# EAGLE schematic SparkFun RTK Facet - Main (EAGLE 9.6.2)

## Sheet 1 of 2
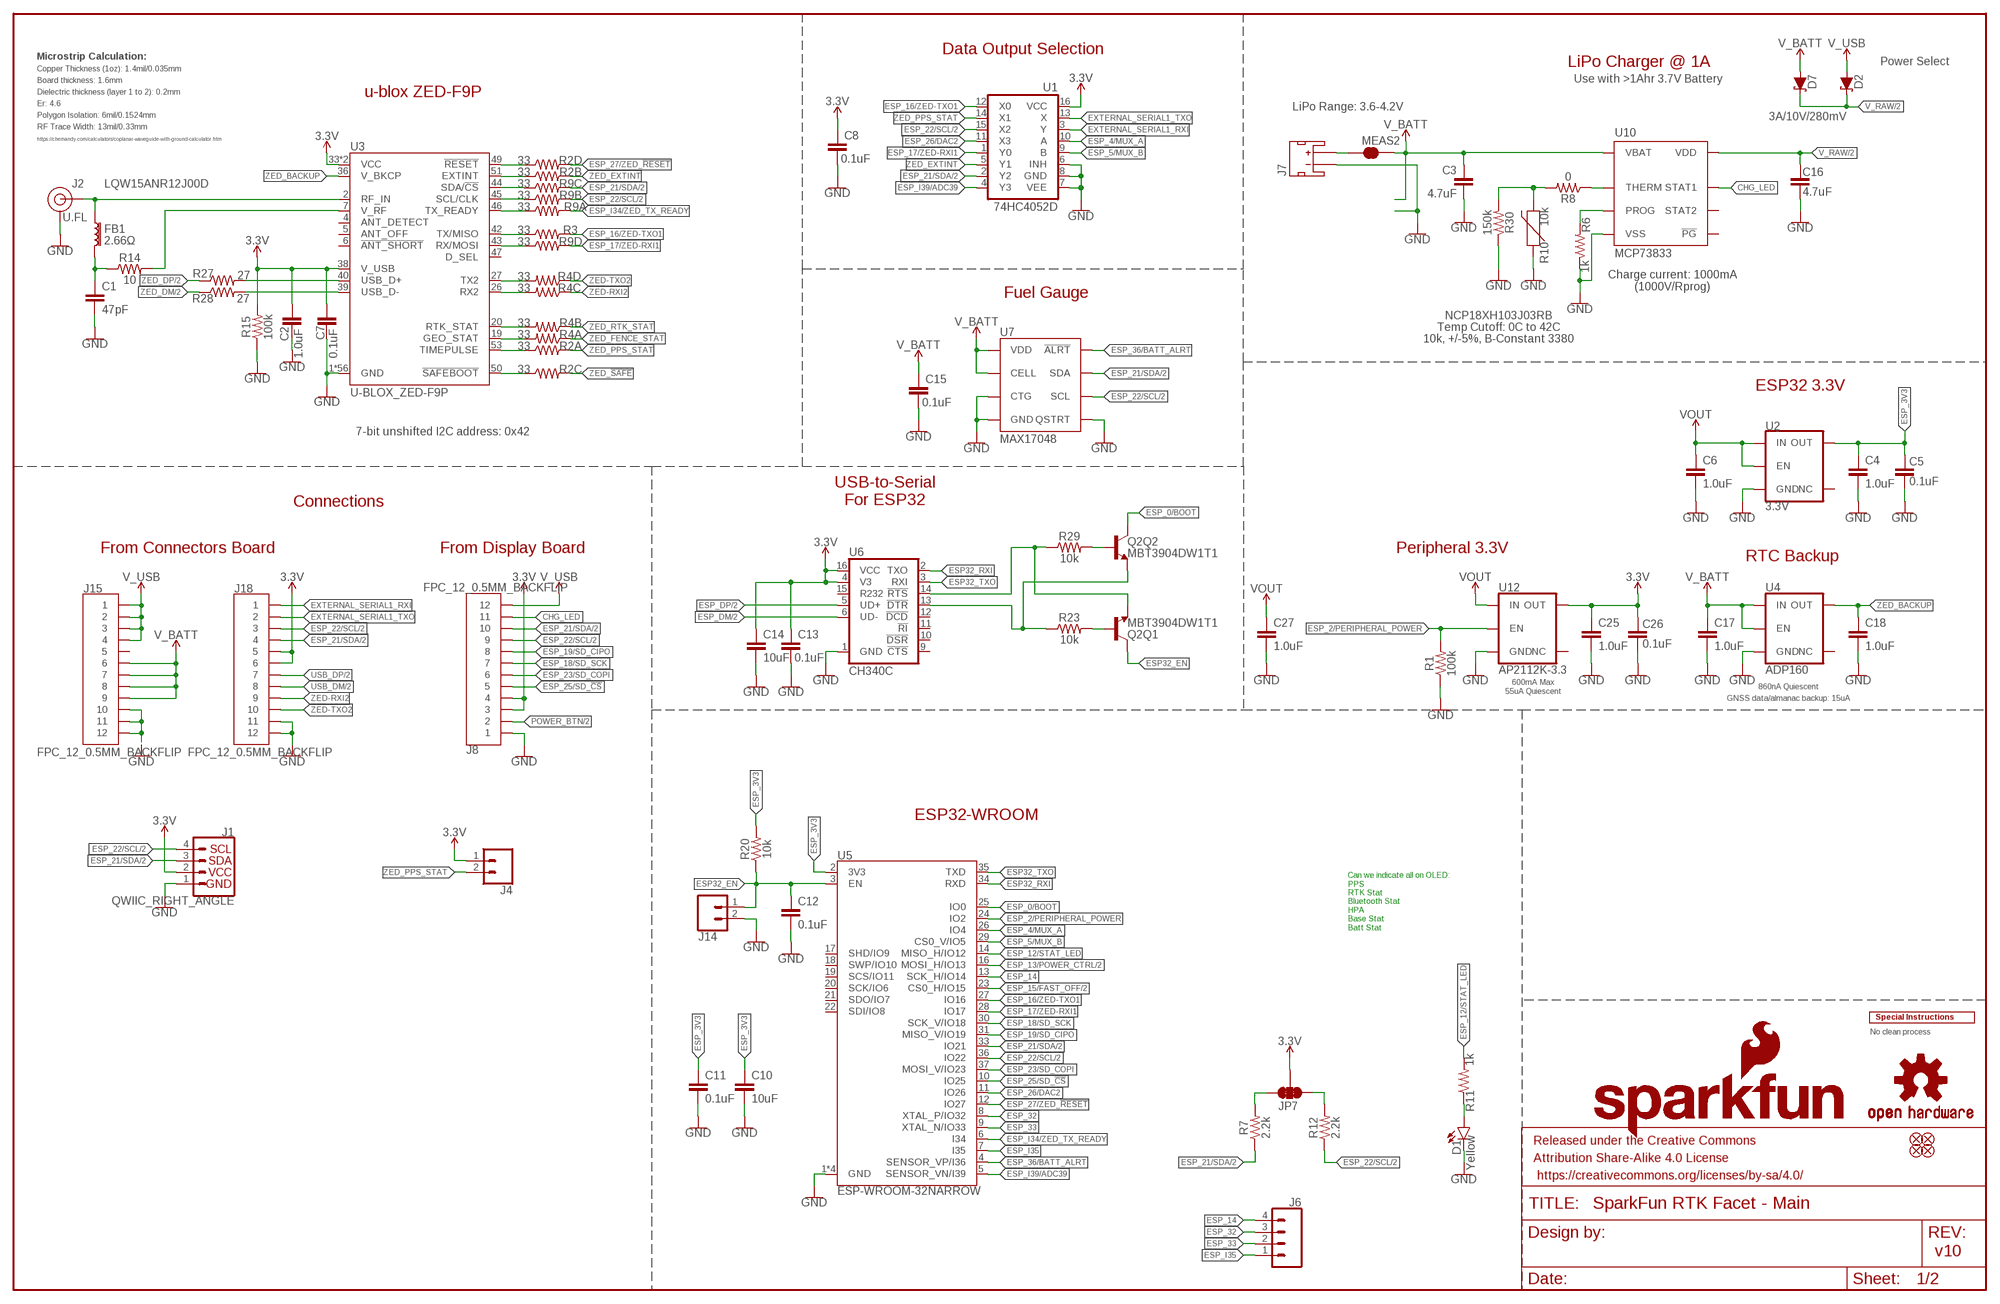
[diagram p0: schematic, sheet 1]

### Parts
C1  47pF  47PF-0402-25V-5%-X7R  [0402]
C2  1.0uF  1.0UF-0603-16V-10%-X7R  [0603]
C3  4.7uF  4.7UF-0603-35V-(20%)  [0603]
C4  1.0uF  1.0UF-0603-16V-10%-X7R  [0603]
C5  0.1uF  0.1UF-0603-25V-5%  [0603]
C6  1.0uF  1.0UF-0603-16V-10%-X7R  [0603]
C7  0.1uF  0.1UF-0603-25V-5%  [0603]
C8  0.1uF  0.1UF-0603-25V-(+80/-20%)  [0603]
C10  10uF  10UF-0603-6.3V-20%  [0603]
C11  0.1uF  0.1UF-0603-25V-(+80/-20%)  [0603]
C12  0.1uF  0.1UF-0603-25V-(+80/-20%)  [0603]
C13  0.1uF  0.1UF-0603-25V-(+80/-20%)  [0603]
C14  10uF  10UF-0603-6.3V-20%  [0603]
C15  0.1uF  0.1UF-0603-25V-(+80/-20%)  [0603]
C16  4.7uF  4.7UF-0603-35V-(20%)  [0603]
C17  1.0uF  1.0UF-0603-16V-10%-X7R  [0603]
C18  1.0uF  1.0UF-0603-16V-10%-X7R  [0603]
C25  1.0uF  1.0UF-0603-16V-10%-X7R  [0603]
C26  0.1uF  0.1UF-0603-25V-5%  [0603]
C27  1.0uF  1.0UF-0603-16V-10%-X7R  [0603]
D1  Yellow  LED-YELLOW0603  [LED-0603]
D2  3A/10V/280mV  DIODE-SCHOTTKY-BAT60A  [SOD-323]
D7  3A/10V/280mV  DIODE-SCHOTTKY-BAT60A  [SOD-323]
FB1  2.66Ω  FERRITE_BEAD-0402-2.66OHM-1GHZ  [0402-TIGHT]
FRAME2  FRAME-LEDGER  [CREATIVE_COMMONS]
J1  QWIIC_RIGHT_ANGLE  QWIIC_CONNECTORJS-1MM  [JST04_1MM_RA]
J2  U.FL  U.FL2PIN  [U.FL]
J4  CONN_021X02_NO_SILK  [1X02_NO_SILK]
J6  CONN_041X04_NO_SILK_NO_POP  [1X04_NO_SILK]
J7  JST_2MM_MALE  [JST-2-SMD]
J8  FPC_12_0.5MM_BACKFLIP  [FPC_12_DOUBLESIDED_BACKFLIP]
J14  CONN_021X02_NO_SILK  [1X02_NO_SILK]
J15  FPC_12_0.5MM_BACKFLIP  [FPC_12_DOUBLESIDED_BACKFLIP]
J18  FPC_12_0.5MM_BACKFLIP  [FPC_12_DOUBLESIDED_BACKFLIP]
JP7  JUMPER-SMT_3_2-NC_TRACE_SILK  [SMT-JUMPER_3_2-NC_TRACE_SILK]
JP21  FIDUCIALUFIDUCIAL  [FIDUCIAL-MICRO]
JP61  FIDUCIALUFIDUCIAL  [FIDUCIAL-MICRO]
JP71  FIDUCIALUFIDUCIAL  [FIDUCIAL-MICRO]
JP81  FIDUCIALUFIDUCIAL  [FIDUCIAL-MICRO]
LOGO1  OSHW-LOGOMINI  [OSHW-LOGO-MINI]
LOGO2  SFE_LOGO_NAME_FLAME.1_INCH  [SFE_LOGO_NAME_FLAME_.1]
MEAS2  JUMPER-COMBO_2_NC_TRACE  [COMBO-JUMPER_2_NC_TRACE]
Q2  MBT3904DW1T1  TRANS_NPN_DUAL-MBT3904DW1T1  [SC70-6]
R1  100k  100KOHM-0603-1/10W-1%  [0603]
R2  33  33OHM_RA-1206-1/16W-5%  [1206_RA]
R3  33  33OHM-0603-1/10W-1%  [0603]
R4  33  33OHM_RA-1206-1/16W-5%  [1206_RA]
R6  1k  1KOHM-0603-1/10W-1%  [0603]
R7  2.2k  2.2KOHM-0603-1/10W-1%  [0603]
R8  0  0OHM-0603-1/10W  [0603]
R9  33  33OHM_RA-1206-1/16W-5%  [1206_RA]
R10  10k  NTC-THERMISTOR-0603  [0603]
R11  1k  1KOHM-0603-1/10W-1%  [0603]
R12  2.2k  2.2KOHM-0603-1/10W-1%  [0603]
R14  10  10OHM-0603-1/10W-1%  [0603]
R15  100k  100KOHM-0603-1/10W-1%  [0603]
R20  10k  10KOHM-0603-1/10W-1%  [0603]
R23  10k  10KOHM-0603-1/10W-1%  [0603]
R27  27  27OHM-0603-1/10W-1%  [0603]
R28  27  27OHM-0603-1/10W-1%  [0603]
R29  10k  10KOHM-0603-1/10W-1%  [0603]
R30  150k  150KOHM-0603-1/10W-1%  [0603]
U1  74HC4052D  [SO16]
U2  3.3V  V_REG_AP2112K-3.3V  [SOT23-5]
U3  U-BLOX_ZED-F9P  [ZED-F9P]
U4  ADP160  [SOT23-5]
U5  ESP-WROOM-32NARROW  [ESP-WROOM-32-NARROW]
U6  CH340C  [SO016]
U7  MAX17048  MAX17048DFN8  [DFN-8]
U10  MCP73833  [DFN-10]
U12  AP2112K-3.3  V_REG_AP2112K-3.3V  [SOT23-5]
U$2  SPECIAL_INSTRUCTIONS-ORDERING  [ORDERING_INSTRUCTIONS]

### Nets
3.3V [power]: C2.1 C7.2 C8.1 C13.1 C14.1 C25.1 C26.2 J1.2 J4.1 J8.3 J8.4 J18.5 J18.6 JP7.2 R15.2 U1.16(VCC) U3.33(VCC) U3.34(VCC) U3.38(V_USB) U6.4(V3) U6.16(VCC) U12.5(OUT) ; also sheet 2
ANT_VCC: C1.1 FB1.2 R14.1
CHG_LED: J8.11 U10.3(STAT1)
CHG_THERM1: R8.2 R10.2 R30.2
ESP32_!DTR: Q2.1(Q2:E) R23.1 U6.13(!DTR)
ESP32_!RTS: Q2.4(Q1:E) R29.1 U6.14(!RTS)
ESP32_EN: C12.1 J14.1 Q2.3(Q1:C) R20.1 U5.3(EN)
ESP32_RXI: U5.34(RXD) U6.2(TXO)
ESP32_TXO: U5.35(TXD) U6.3(RXI)
ESP_0/BOOT: Q2.6(Q2:C) U5.25(IO0)
ESP_2/PERIPHERAL_POWER: R1.2 U5.24(IO2) U12.3(EN)
ESP_3V3 [power]: C4.1 C5.2 C10.1 C11.1 R20.2 U2.5(OUT) U5.2(3V3)
ESP_4/MUX_A: U1.10(A) U5.26(IO4)
ESP_5/MUX_B: U1.9(B) U5.29(CS0_V/IO5)
ESP_12/STAT_LED: R11.2 U5.14(MISO_H/IO12)
ESP_13/POWER_CTRL: U5.16(MOSI_H/IO13) ; also sheet 2
ESP_14: J6.4 U5.13(SCK_H/IO14)
ESP_15/FAST_OFF: U5.23(CS0_H/IO15) ; also sheet 2
ESP_16/ZED-TXO1: R3.2 U1.12(X0) U5.27(IO16)
ESP_17/ZED-RXI1: R9.P5 U1.1(Y0) U5.28(IO17)
ESP_18/SD_SCK: J8.7 U5.30(SCK_V/IO18)
ESP_19/SD_CIPO: J8.8 U5.31(MISO_V/IO19)
ESP_21/SDA: J1.3 J8.10 J18.4 R7.1 R9.P6 U1.2(Y2) U5.33(IO21) U7.8(SDA) ; also sheet 2
ESP_22/SCL: J1.4 J8.9 J18.3 R9.P7 R12.1 U1.15(X2) U5.36(IO22) U7.7(SCL) ; also sheet 2
ESP_23/SD_COPI: J8.6 U5.37(MOSI_V/IO23)
ESP_25/SD_!CS!: J8.5 U5.10(IO25)
ESP_26/DAC2: U1.11(X3) U5.11(IO26)
ESP_27/ZED_!RESET!: R2.P5 U5.12(IO27)
ESP_32: J6.3 U5.8(XTAL_P/IO32)
ESP_33: J6.2 U5.9(XTAL_N/IO33)
ESP_36/BATT_ALRT: U5.4(SENSOR_VP/I36) U7.5(!ALRT)
ESP_DM: U6.6(UD-) ; also sheet 2
ESP_DP: U6.5(UD+) ; also sheet 2
ESP_I34/ZED_TX_READY: R9.P8 U5.6(I34)
ESP_I35: J6.1 U5.7(I35)
ESP_I39/ADC39: U1.4(Y3) U5.5(SENSOR_VN/I39)
EXTERNAL_SERIAL1_RXI: J18.1 U1.3(Y)
EXTERNAL_SERIAL1_TXO: J18.2 U1.13(X)
FENCE_LV: R4.P8 U3.19(GEO_STAT)
GND: C1.2 C2.2 C3.2 C4.2 C5.1 C6.2 C7.1 C8.2 C10.2 C11.2 C12.2 C13.2 C14.2 C15.2 C16.2 C17.2 C18.2 C25.2 C26.1 C27.2 D1.C J1.1 J2.1(GND) J2.2(GND) J7.1(-) J8.1 J14.2 J15.10 J15.11 J15.12 J18.11 J18.12 R1.1 R6.1 R10.1 R15.1 R30.1 U1.6(INH) U1.7(VEE) U1.8(GND) U2.2(GND) U3.1(GND) U3.3(GND) U3.12(GND) U3.14(GND) U3.32(GND) U3.37(GND) U3.41(GND) U3.48(GND) U3.55(GND) U3.56(GND) U3.57(GND) U3.58(GND) U3.59(GND) U3.60(GND) U3.61(GND) U3.62(GND) U3.63(GND) U3.64(GND) U3.65(GND) U3.66(GND) U3.67(GND) U3.68(GND) U3.69(GND) U3.70(GND) U3.71(GND) U3.72(GND) U3.73(GND) U3.74(GND) U3.75(GND) U3.76(GND) U3.77(GND) U3.78(GND) U3.79(GND) U3.80(GND) U3.81(GND) U3.82(GND) U3.83(GND) U3.84(GND) U3.85(GND) U3.86(GND) U3.87(GND) U3.88(GND) U3.89(GND) U3.90(GND) U3.91(GND) U3.92(GND) U3.93(GND) U3.94(GND) U3.95(GND) U3.96(GND) U3.97(GND) U3.98(GND) U3.99(GND) U3.100(GND) U3.101(GND) U3.102(GND) U4.2(GND) U5.1(GND) U5.15(GND) U5.38(GND) U5.GND U6.1(GND) U7.1(CTG) U7.4(GND) U7.6(QSTRT) U7.9(GND) U10.5(VSS) U10.11(VSS) U12.2(GND) ; also sheet 2
GPS_ANT1 [RF]: FB1.1 J2.FEED(SIGNAL) U3.2(RF_IN)
LIPO_RAW: J7.2(+) MEAS2.1 MEAS2.3
N$1: R8.1 U10.8(THERM)
N$2: D1.A R11.1
N$3: JP7.3 R7.2
N$4: JP7.1 R12.2
N$5: R2.P2 U3.51(EXTINT)
N$11: R27.2 U3.40(USB_D+)
N$12: R28.2 U3.39(USB_D-)
N$13: R14.2 U3.7(V_RF)
N$16: R2.P4 U3.49(!RESET!)
N$18: R2.P3 U3.50(!SAFEBOOT!)
N$22: R9.P1 U3.46(TX_READY)
N$24: Q2.5(Q1:B) R23.2
N$25: Q2.2(Q2:B) R29.2
POWER_BTN: J8.2 ; also sheet 2
PPS: R2.P1 U3.53(TIMEPULSE)
PROG1: R6.2 U10.6(PROG)
RTK_LV: R4.P7 U3.20(RTK_STAT)
RX2_LV: R4.P6 U3.26(RX2)
RXLV: R9.P4 U3.43(RX/MOSI)
SCL_LV: R9.P2 U3.45(SCL/CLK)
SDA_LV: R9.P3 U3.44(SDA/!CS!)
TX2_LV: R4.P5 U3.27(TX2)
TXLV: R3.1 U3.42(TX/MISO)
USB_DM: J18.8 ; also sheet 2
USB_DP: J18.7 ; also sheet 2
V_BATT [power]: C3.1 C15.1 C17.1 D7.A J15.6 J15.7 J15.8 J15.9 MEAS2.2 MEAS2.4 U4.1(IN) U4.3(EN) U7.2(CELL) U7.3(VDD) U10.9(VBAT) U10.10(VBAT)
V_RAW [power]: C16.1 D2.C D7.C U10.1(VDD) U10.2(VDD) ; also sheet 2
V_USB [power]: D2.A J8.12 J15.1 J15.2 J15.3 J15.4 ; also sheet 2
VOUT [power]: C6.1 C27.1 U2.1(IN) U2.3(EN) U12.1(IN) ; also sheet 2
ZED-RXI2: J18.9 R4.P3
ZED-TXO2: J18.10 R4.P4
ZED_!SAFE!: R2.P6
ZED_BACKUP: C18.1 U3.36(V_BKCP) U4.5(OUT)
ZED_DM: R28.1 ; also sheet 2
ZED_DP: R27.1 ; also sheet 2
ZED_EXTINT: R2.P7 U1.5(Y1)
ZED_FENCE_STAT: R4.P1
ZED_PPS_STAT: J4.2 R2.P8 U1.14(X1)
ZED_RTK_STAT: R4.P2
Unconnected: J7.NC1(PAD1) J7.NC2(PAD2) J15.5 U2.4(NC) U3.4(ANT_DETECT) U3.5(ANT_OFF) U3.6(!ANT_SHORT!) U3.47(D_SEL) U4.4(NC) U5.17(SHD/IO9) U5.18(SWP/IO10) U5.19(SCS/IO11) U5.20(SCK/IO6) U5.21(SDO/IO7) U5.22(SDI/IO8) U6.9(!CTS) U6.10(!DSR) U6.11(!RI) U6.12(!DCD) U6.15(R232) U10.4(STAT2) U10.7(!PG) U12.4(NC)

### Notes on the sheet
- Data Output Selection
- Microstrip Calculation: | LiPo Charger @ 1A | Power Select
- Copper Thickness (1oz): 1.4mil/0.035mm
- Use with >1Ahr 3.7V Battery
- Board thickness: 1.6mm
- u-blox ZED-F9P
- Dielectric thickness (layer 1 to 2): 0.2mm
- Er: 4.6 | LiPo Range: 3.6-4.2V
- Polygon Isolation: 6mil/0.1524mm
- RF Trace Width: 13mil/0.33mm
- https://chemandy.com/calculators/coplanar-waveguide-with-ground-calculator.htm
- LQW15ANR12J00D
- Charge current: 1000mA
  (1000V/Rprog)
- Fuel Gauge
- NCP18XH103J03RB
- Temp Cutoff: 0C to 42C
- 10k, +/-5%, B-Constant 3380
- ESP32 3.3V
- 7-bit unshifted I2C address: 0x42
- USB-to-Serial
  For ESP32
- Connections
- From Connectors Board | From Display Board | Peripheral 3.3V
- RTC Backup
- 600mA Max
  55uA Quiescent
- 860nA Quiescent
- GNSS data/almanac backup: 15uA
- ESP32-WROOM
- Can we indicate all on OLED:
  PPS
  RTK Stat
  Bluetooth Stat
  HPA
  Base Stat
  Batt Stat
- No clean process
- v10

## Sheet 2 of 2
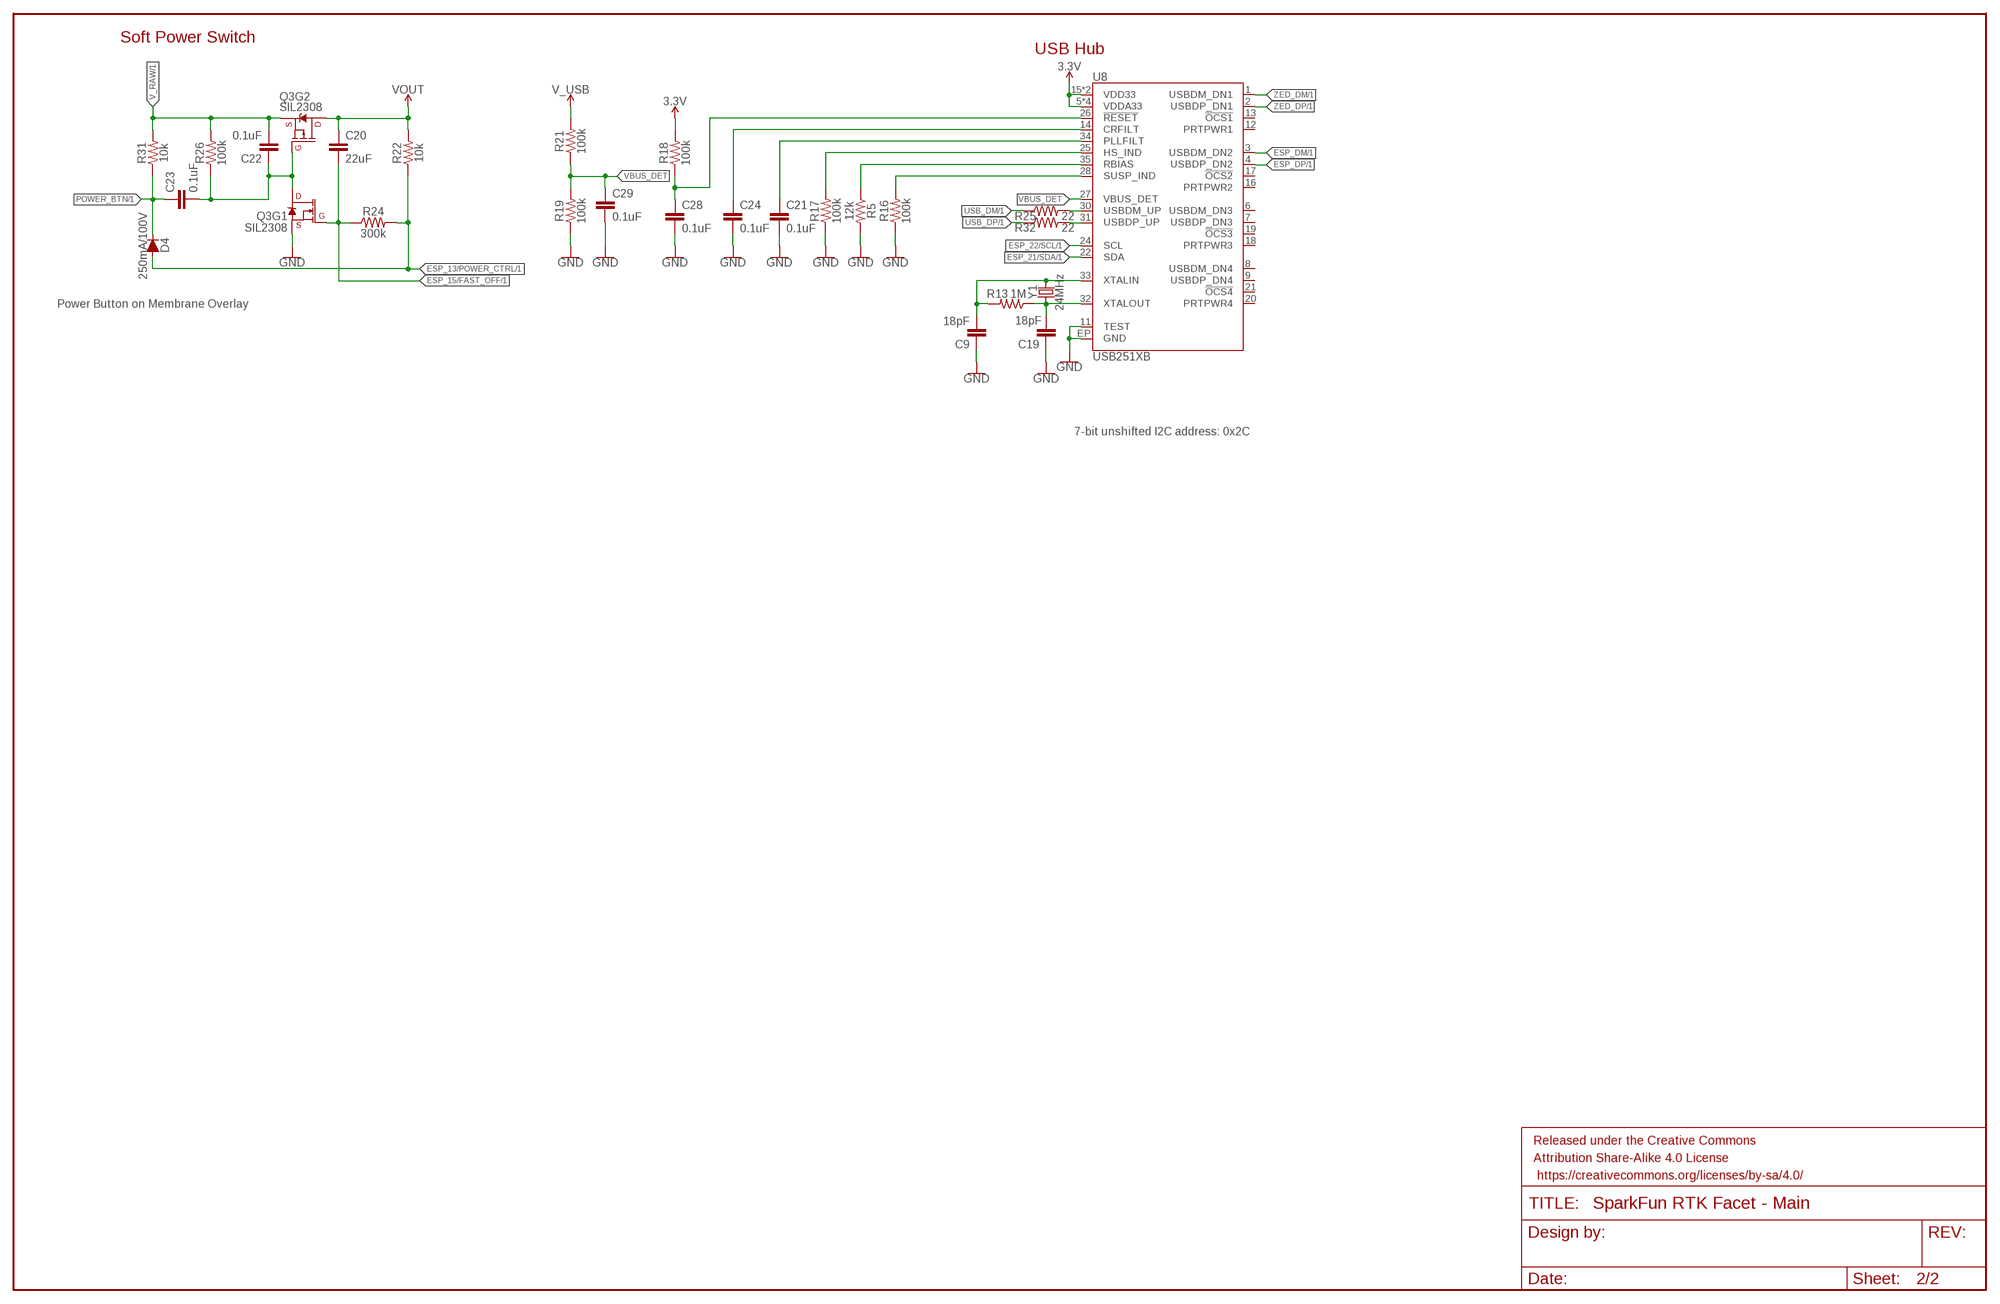
[diagram p1: schematic, sheet 2]

### Parts
C9  18pF  18PF-0603-50V-5%  [0603]
C19  18pF  18PF-0603-50V-5%  [0603]
C20  22uF  22UF-0603-6.3V-20%  [0603]
C21  0.1uF  0.1UF-0603-25V-5%  [0603]
C22  0.1uF  0.1UF-0603-25V-5%  [0603]
C23  0.1uF  0.1UF-0603-25V-5%  [0603]
C24  0.1uF  0.1UF-0603-25V-5%  [0603]
C28  0.1uF  0.1UF-0603-25V-5%  [0603]
C29  0.1uF  0.1UF-0603-25V-5%  [0603]
D4  250mA/100V  DIODE-BAS16J  [SOD-323]
FRAME1  FRAME-LEDGER  [CREATIVE_COMMONS]
Q3  SIL2308  MOSFET_COMPLIMENTARY_PAIR-SIL2308  [SOT26]
R5  12k  12KOHM-0603-1/10W-1%  [0603]
R13  1M  1MOHM-0603-1/4W-5%  [0603]
R16  100k  100KOHM-0603-1/10W-1%  [0603]
R17  100k  100KOHM-0603-1/10W-1%  [0603]
R18  100k  100KOHM-0603-1/10W-1%  [0603]
R19  100k  100KOHM-0603-1/10W-1%  [0603]
R21  100k  100KOHM-0603-1/10W-1%  [0603]
R22  10k  10KOHM-0603-1/10W-1%  [0603]
R24  300k  300KOHM-0603-1/10W-1%  [0603]
R25  22  22OHM-0603-1/10W-1%  [0603]
R26  100k  100KOHM-0603-1/10W-1%  [0603]
R31  10k  10KOHM-0603-1/10W-1%  [0603]
R32  22  22OHM-0603-1/10W-1%  [0603]
U8  USB251XB  [QFN-36]
Y1  24MHz  CRYSTAL-24MHZ-SMD-2.0X1.6MM  [CRYSTAL-SMD-2.0X1.6MM]

### Nets
3.3V [power]: R18.2 U8.5(VDDA33) U8.10(VDDA33) U8.15(VDD33) U8.23(VDD33) U8.29(VDDA33) U8.36(VDDA33) ; also sheet 1
ESP_13/POWER_CTRL: D4.A R22.1 R24.2 ; also sheet 1
ESP_15/FAST_OFF: C20.2 Q3.G1(G) R24.1 ; also sheet 1
ESP_21/SDA: U8.22(SDA) ; also sheet 1
ESP_22/SCL: U8.24(SCL) ; also sheet 1
ESP_DM: U8.3(USBDM_DN2) ; also sheet 1
ESP_DP: U8.4(USBDP_DN2) ; also sheet 1
GND: C9.1 C19.1 C21.2 C24.2 C28.2 C29.2 Q3.S1(S) R5.2 R16.1 R17.1 R19.1 U8.11(TEST) U8.EP(GND) ; also sheet 1
N$6: C22.1 C23.2 Q3.D1(D) Q3.G2(G) R26.1
N$7: C9.2 R13.2 U8.33(XTALIN) Y1.3
N$8: C19.2 R13.1 U8.32(XTALOUT) Y1.1
N$9: R5.1 U8.35(RBIAS)
N$10: R16.2 U8.28(SUSP_IND)
N$14: R17.2 U8.25(HS_IND)
N$15: C21.1 U8.34(PLLFILT)
N$17: C24.1 U8.14(CRFILT)
N$19: R25.2 U8.30(USBDM_UP)
N$20: R32.2 U8.31(USBDP_UP)
POWER_BTN: C23.1 D4.C R31.1 ; also sheet 1
USB_!RESET: C28.1 R18.1 U8.26(!RESET)
USB_DM: R25.1 ; also sheet 1
USB_DP: R32.1 ; also sheet 1
V_RAW [power]: C22.2 Q3.S2(S) R26.2 R31.2 ; also sheet 1
V_USB [power]: R21.2 ; also sheet 1
VBUS_DET: C29.1 R19.2 R21.1 U8.27(VBUS_DET)
VOUT [power]: C20.1 Q3.D2(D) R22.2 ; also sheet 1
ZED_DM: U8.1(USBDM_DN1) ; also sheet 1
ZED_DP: U8.2(USBDP_DN1) ; also sheet 1
Unconnected: U8.6(USBDM_DN3) U8.7(USBDP_DN3) U8.8(USBDM_DN4) U8.9(USBDP_DN4) U8.12(PRTPWR1) U8.13(!OCS1) U8.16(PRTPWR2) U8.17(!OCS2) U8.18(PRTPWR3) U8.19(!OCS3) U8.20(PRTPWR4) U8.21(!OCS4)

### Notes on the sheet
- Soft Power Switch
- USB Hub
- Power Button on Membrane Overlay
- 7-bit unshifted I2C address: 0x2C

## Library data of the parts
C1 = SparkFun-Capacitors:47PF: 47pF ceramic capacitors A capacitor is a passive two-terminal electrical component used to store electrical energy temporarily in an electric field.; PROD_ID: CAP-15063
C2 C4 C6 C17 C18 C25 C27 = SparkFun-Capacitors:1.0UF: 1µF ceramic capacitors A capacitor is a passive two-terminal electrical component used to store electrical energy temporarily in an electric field.; PROD_ID: CAP-13930
C3 C16 = SparkFun-Capacitors:4.7UF: 4.7µF ceramic capacitors A capacitor is a passive two-terminal electrical component used to store electrical energy temporarily in an electric field.; PROD_ID: CAP-14106
C5 C7 C21-C24 C26 C28 C29 = SparkFun-Capacitors:0.1UF: 0.1µF ceramic capacitors A capacitor is a passive two-terminal electrical component used to store electrical energy temporarily in an electric field.; PROD_ID: CAP-08604
C8 C11-C13 C15 = SparkFun-Capacitors:0.1UF: 0.1µF ceramic capacitors A capacitor is a passive two-terminal electrical component used to store electrical energy temporarily in an electric field.; PROD_ID: CAP-00810
C9 C19 = SparkFun-Capacitors:18PF: 18pF ceramic capacitors A capacitor is a passive two-terminal electrical component used to store electrical energy temporarily in an electric field.; PROD_ID: CAP-08267
C10 C14 = SparkFun-Capacitors:10UF: 10.0µF ceramic capacitors A capacitor is a passive two-terminal electrical component used to store electrical energy temporarily in an electric field.; PROD_ID: CAP-11015
C20 = SparkFun-Capacitors:22UF: 22µF ceramic capacitors A capacitor is a passive two-terminal electrical component used to store electrical energy temporarily in an electric field.; PROD_ID: CAP-14464
D1 = SparkFun-LED:LED-YELLOW: Yellow SMD LED Used in manufacturing several products at SparkFun. Packages: 0603 - SMD 0603 package[Product Link] <http://www.kingbrightusa.com/product.asp?catalog_name=LED&product_id=APT1608SYCK> 0603 -SMART - SMART SMD 0603 package (more efficient/more expensive) [Product Link] <http://www.osram-os.com/osram_os/en/products/product-catalog/led-light-emitting-diodes/smartled-0603/ly-l29k/index.jsp> LilyPad - SMD1206 package[Product Datasheet] <https://www.sparkfun.com/datasheets/DevTools/LilyPad/Q150YUS4.pdf> SparkFun Products: Blynk Board <https://www.sparkfun.com/products/13794> IOIO-OTG <https://www.sparkfun.com/products/13613> XBee Explorer Serial <https://www.sparkfun.com/products/13225>; PROD_ID: DIO-09003
D2 D7 = SparkFun-DiscreteSemi:DIODE-SCHOTTKY: Schottky diode A Schottky diode is a semiconductor diode which has a low forward voltage drop and a very fast switching action.; PROD_ID: DIO-14072
D4 = SparkFun-DiscreteSemi:DIODE: Diode These are standard reverse protection diodes and small signal diodes. SparkFun Products: SparkFun SparkPunk Sound Kit <https://www.sparkfun.com/products/11177> SparkFun ESP8266 Thing <https://www.sparkfun.com/products/13231>; PROD_ID: DIO-09646
FB1 = SparkFun-Coils:FERRITE_BEAD: Ferrite Bead (blocks, cores, rings, chokes, etc.) Inductor with layers of ferrite used to suppress high frequencies. Often used to isolate high frequency noise. SparkFun Products: IOIO-OTG - V2.2 <https://www.sparkfun.com/products/13613> SparkFun SAMD21 Mini Breakout <https://www.sparkfun.com/products/13664> SparkFun 6 Degrees of Freedom Breakout - LSM6DS3 <https://www.sparkfun.com/products/13339> SparkFun SAMD21 Dev Breakout <https://www.sparkfun.com/products/13672>; PROD_ID: NDUC-15072
FRAME1 FRAME2 = SparkFun-Aesthetics:FRAME-LEDGER: Schematic Frame - Ledger Standard 11x14 US Ledger frame
J1 = SparkFun-Connectors:QWIIC_CONNECTOR: SparkFun I2C Standard Qwiic Connector An SMD 1mm pitch JST connector makes it easy and quick (get it? Qwiic?) to connect I2C devices to each other. The Qwiic system <http://www.sparkfun.com/qwiic> enables fast and solderless connection between popular platforms and various sensors and actuators. We carry 200mm <https://www.sparkfun.com/products/14204>, 100mm <https://www.sparkfun.com/products/14205>, 50mm <https://www.sparkfun.com/products/14206>, and breadboard friendly <https://www.sparkfun.com/products/14207> Qwiic cables. We also offer 10 pcs strips <https://www.sparkfun.com/products/14323> the SMD connectors.; PROD_ID: CONN-13694
J2 = SparkFun-Connectors:U.FL2PIN: SMD Antenna Connector - U.FL 2mm height, 3.0mm x 3.0mm receptacle size. SparkFun Products: SparkFun WiFi Shield - ESP8266 <https://www.sparkfun.com/products/13287> SparkFun ESP8266 Thing <https://www.sparkfun.com/products/13231> SparkFun MiniGen - Pro Mini Signal Generator Shield <https://www.sparkfun.com/products/11420>; PROD_ID: CONN-09193; SF_ID: WRL-09144
J4 J14 = SparkFun-Connectors:CONN_02: Multi connection point. Often used as Generic Header-pin footprint for 0.1 inch spaced/style header connections On any of the 0.1 inch spaced packages, you can populate with these: Break Away Headers - Straight <https://www.sparkfun.com/products/116> (PRT-00116) Break Away Male Headers - Right Angle <https://www.sparkfun.com/products/553> (PRT-00553) Female Headers <https://www.sparkfun.com/products/115> (PRT-00115) Break Away Headers - Machine Pin <https://www.sparkfun.com/products/117> (PRT-00117) Break Away Female Headers - Swiss Machine Pin <https://www.sparkfun.com/products/743> (PRT-00743) For SCREWTERMINALS and SPRING TERMINALS visit here: Screw Terimnals on SparkFun.com <https://www.sparkfun.com/search/results?term=Screw+Terminals> (5mm/3.5mm/2.54mm spacing) This device is also useful as a general connection point to wire up your design to another part of your project. Our various solder wires solder well into these plated through hole pads. Hook-Up Wire - Assortment (Stranded, 22 AWG) <https://www.sparkfun.com/products/11375> (PRT-11375) Hook-Up Wire - Assortment (Solid Core, 22 AWG) <https://www.sparkfun.com/products/11367> (PRT-11367) View the entire wire category on our website here <https://www.sparkfun.com/categories/141> Special notes: Molex polarized connector foot print use with: PRT-08233 with associated crimp pins and housings. 2.54_SCREWTERM for use with PRT-10571. 3.5mm Screw Terminal footprints for PRT-08084 5mm Screw Terminal footprints for use with PRT-08432
J6 = SparkFun-Connectors:CONN_04: Multi connection point. Often used as Generic Header-pin footprint for 0.1 inch spaced/style header connections On any of the 0.1 inch spaced packages, you can populate with these: Break Away Headers - Straight <https://www.sparkfun.com/products/116> (PRT-00116) Break Away Male Headers - Right Angle <https://www.sparkfun.com/products/553> (PRT-00553) Female Headers <https://www.sparkfun.com/products/115> (PRT-00115) Break Away Headers - Machine Pin <https://www.sparkfun.com/products/117> (PRT-00117) Break Away Female Headers - Swiss Machine Pin <https://www.sparkfun.com/products/743> (PRT-00743) For SCREWTERMINALS and SPRING TERMINALS visit here: Screw Terimnals on SparkFun.com <https://www.sparkfun.com/search/results?term=Screw+Terminals> (5mm/3.5mm/2.54mm spacing) This device is also useful as a general connection point to wire up your design to another part of your project. Our various solder wires solder well into these plated through hole pads. Hook-Up Wire - Assortment (Stranded, 22 AWG) <https://www.sparkfun.com/products/11375> (PRT-11375) Hook-Up Wire - Assortment (Solid Core, 22 AWG) <https://www.sparkfun.com/products/11367> (PRT-11367) View the entire wire category on our website here <https://www.sparkfun.com/categories/141> Special notes: Molex polarized connector foot print use with SKU : PRT-08231 with associated crimp pins and housings. 1MM SMD Version SKU: PRT-10208
J7 = SparkFun-Connectors:JST_2MM_MALE: JST 2MM MALE RA CONNECTOR Two pin, compact surface mount connector. Commonly used as a battery input connection point. We really like the solid locking feeling and high current rating on these small connectors. We use these all the time as battery connectors. Mates to single-cell LiPo batteries. Here is the connector we sell at SparkFun: JST Right Angle Connector - White <https://www.sparkfun.com/products/8612> (PRT-08612) Datasheet <http://www.sparkfun.com/datasheets/Prototyping/Connectors/JST-Horizontal.pdf> It was used on these SparkFun products: SparkFun MOSFET Power Controller <https://www.sparkfun.com/products/11214> (PRT-11214) SparkFun Battery Babysitter - LiPo Battery Manager <https://www.sparkfun.com/products/13777> (PRT-13777) And many, many others that required a lipo battery connection.; PROD_ID: CONN-11443; SF_ID: PRT-08612
J8 J15 J18 = RTK Facet:FPC_12_0.5MM; PROD_ID: CONN-15766
JP7 = SparkFun-Jumpers:JUMPER-SMT_3_2-NC_TRACE: Normally closed trace jumper (2 of 2 connections) This jumper has a trace between all three pads so they are normally closed (NC). Use a razor knife to open the connection(s). For best results follow the IPC guidelines for cutting traces: Cutout at least 0.063 mm (0.005 in). Remove all loose material to clean up the cut area. Seal the cut with an approved epoxy. Reapply solder to reclose the connection(s).
JP21 JP61 JP71 JP81 = SparkFun-Aesthetics:FIDUCIAL: Fiducial Alignment Points Point-of-reference for pick-and-place machines and other optical instruments.
LOGO1 = SparkFun-Aesthetics:OSHW-LOGO: Open-Source Hardware (OSHW) Logo This logo indicates the piece of hardware it is found on incorporates a OSHW license and/or adheres to the definition of open source hardware found here: http://freedomdefined.org/OSHW
LOGO2 = SparkFun-Aesthetics:SFE_LOGO_NAME_FLAME: SparkFun Font Logo w/ Flame This is the SparkFun full logo. The logo on the schematic will always be the same size; the package variant is the height of the flame part of the logo. Default layer for the logo on the board is tSilk.
MEAS2 = SparkFun-Jumpers:JUMPER-COMBO_2_NC_TRACE
Q2 = SparkFun-DiscreteSemi:TRANS_NPN_DUAL: Dual NPN Transistors in Single Package The MBT3904W1 puts two general purpose 3904 NPN transistors in a single package. Datasheet <http://www.onsemi.com/pub_link/Collateral/MBT3904DW1T1-D.PDF> SparkFun Products: SparkFun ESP32 Thing <https://www.sparkfun.com/products/13907>; PROD_ID: TRANS-13337
Q3 = SparkFun-DiscreteSemi:MOSFET_COMPLIMENTARY_PAIR: Complementary pair enhancement mode MOSFET 1A and 4A A P and N channel MOSFET in a single package. Rated to breakdown at 20V. DMC2700 is 1A. SIL2308 is 4A. Link to datasheet <http://www.diodes.com/_files/datasheets/DMC2700UDM.pdf> SparkFun Products: ZX Distance and Gesture Sensor <https://www.sparkfun.com/products/12780>; PROD_ID: TRANS-15717
R1 R15-R19 R21 R26 = SparkFun-Resistors:100KOHM: 100kΩ resistor A resistor is a passive two-terminal electrical component that implements electrical resistance as a circuit element. Resistors act to reduce current flow, and, at the same time, act to lower voltage levels within circuits. - Wikipedia; PROD_ID: RES-07828
R2 R4 R9 = SparkFun-Resistors:33OHM_RA: EXB-38V330JV Four Resistory Array - AEC-Q200 Certified; PROD_ID: RES-15081
R3 = SparkFun-Resistors:33OHM: 33Ω resistor A resistor is a passive two-terminal electrical component that implements electrical resistance as a circuit element. Resistors act to reduce current flow, and, at the same time, act to lower voltage levels within circuits. - Wikipedia; PROD_ID: RES-08270
R5 = SparkFun-Resistors:12KOHM: 12kΩ resistor A resistor is a passive two-terminal electrical component that implements electrical resistance as a circuit element. Resistors act to reduce current flow, and, at the same time, act to lower voltage levels within circuits. - Wikipedia; PROD_ID: RES-10327
R6 R11 = SparkFun-Resistors:1KOHM: 1kΩ resistor A resistor is a passive two-terminal electrical component that implements electrical resistance as a circuit element. Resistors act to reduce current flow, and, at the same time, act to lower voltage levels within circuits. - Wikipedia; PROD_ID: RES-07856
R7 R12 = SparkFun-Resistors:2.2KOHM: 2.2kΩ resistor A resistor is a passive two-terminal electrical component that implements electrical resistance as a circuit element. Resistors act to reduce current flow, and, at the same time, act to lower voltage levels within circuits. - Wikipedia; PROD_ID: RES-08272
R8 = SparkFun-Resistors:0OHM: 0Ω resistor A resistor is a passive two-terminal electrical component that implements electrical resistance as a circuit element. Resistors act to reduce current flow, and, at the same time, act to lower voltage levels within circuits. - Wikipedia; PROD_ID: RES-08609
R10 = SparkFun-Resistors:NTC-THERMISTOR: NTC Thermistor An NTC thermistor's resistance decreases as temperature rises. Applications: Resistance Thermometer - temperature monitoring Inrush current limiter Heat source; PROD_ID: RES-13608
R13 = SparkFun-Resistors:1MOHM: 1MΩ resistor A resistor is a passive two-terminal electrical component that implements electrical resistance as a circuit element. Resistors act to reduce current flow, and, at the same time, act to lower voltage levels within circuits. - Wikipedia; PROD_ID: RES-07868
R14 = SparkFun-Resistors:10OHM: 10Ω resistor A resistor is a passive two-terminal electrical component that implements electrical resistance as a circuit element. Resistors act to reduce current flow, and, at the same time, act to lower voltage levels within circuits. - Wikipedia; PROD_ID: RES-12581
R20 R22 R23 R29 R31 = SparkFun-Resistors:10KOHM: 10kΩ resistor A resistor is a passive two-terminal electrical component that implements electrical resistance as a circuit element. Resistors act to reduce current flow, and, at the same time, act to lower voltage levels within circuits. - Wikipedia; PROD_ID: RES-00824
R24 = SparkFun-Resistors:300KOHM: 300kΩ resistor A resistor is a passive two-terminal electrical component that implements electrical resistance as a circuit element. Resistors act to reduce current flow, and, at the same time, act to lower voltage levels within circuits. - Wikipedia; PROD_ID: RES-10809
R25 R32 = SparkFun-Resistors:22OHM: 22Ω resistor A resistor is a passive two-terminal electrical component that implements electrical resistance as a circuit element. Resistors act to reduce current flow, and, at the same time, act to lower voltage levels within circuits. - Wikipedia; PROD_ID: RES-08698
R27 R28 = SparkFun-Resistors:27OHM: 27Ω resistor A resistor is a passive two-terminal electrical component that implements electrical resistance as a circuit element. Resistors act to reduce current flow, and, at the same time, act to lower voltage levels within circuits. - Wikipedia; PROD_ID: RES-09334
R30 = SparkFun-Resistors:150KOHM: 150kΩ resistor A resistor is a passive two-terminal electrical component that implements electrical resistance as a circuit element. Resistors act to reduce current flow, and, at the same time, act to lower voltage levels within circuits. - Wikipedia; PROD_ID: RES-09117
U1 = SparkFun-IC-Logic:74*4052: Dual 4:1 Analog Mux Dual four-channel analog MULTIPLEXER / DEMULTIPLEXER SparkFun Products SparkFun Vernier Interface Shield <https://www.sparkfun.com/products/12858> (DEV-12858); PROD_ID: IC-13103
U2 = SparkFun-IC-Power:V_REG_AP2112: AP2112 - 600mA CMOS LDO Regulator w/ Enable The AP2112 is CMOS process low dropout linear regulator with enable function, the regulator delivers a guaranteed 600mA (min.) continuous load current. Features Output Voltage Accuracy: ±1.5% Output Current: 600mA (Min.) Foldback Short Current Protection: 50mA Enable Function to Turn ON/OFF VOUT Low Dropout Voltage (3.3V): 250mV (Typ.) @IOUT=600mA Excellent Load Regulation: 0.2%/A (Typ.) Excellent Line Regulation: 0.02%/V (Typ.) Low Quiescent Current: 55μA (Typ.) Low Standby Current: 0.01μA (Typ.) Low Output Noise: 50μVRMS PSRR: 100Hz -65dB, 1kHz -65dB OTSD Protection Stable with 1.0μF Flexible Cap: Ceramic, Tantalum and Aluminum Electrolytic Operation Temperature Range: -40°C to 85°C ESD: MM 400V, HBM 4000V; PROD_ID: VREG-12457
U3 = SparkFun-GPS:U-BLOX_ZED-F9P; PROD_ID: IC-14209
U4 = SparkFun-IC-Power:ADP160: Nanopower LDO Iq less than 1uA for low Iload; PROD_ID: VREG-11306
U5 = SparkFun-RF:ESP-WROOM-32; PROD_ID: IC-13849
U6 = SparkFun-IC-Comms:CH340C; PROD_ID: IC-14038
U7 = SparkFun-IC-Power:MAX17048: Micropower 1-Cell Li+ ModelGauge SparkFun Products Qduino Mini <https://www.sparkfun.com/products/13614> (DEV-13614); PROD_ID: IC-12551
U8 = USB251xB:USB251XB
U10 = SparkFun-IC-Power:MCP73833; PROD_ID: IC-14369
U12 = SparkFun-IC-Power:V_REG_AP2112: AP2112 - 600mA CMOS LDO Regulator w/ Enable The AP2112 is CMOS process low dropout linear regulator with enable function, the regulator delivers a guaranteed 600mA (min.) continuous load current. Features Output Voltage Accuracy: ±1.5% Output Current: 600mA (Min.) Foldback Short Current Protection: 50mA Enable Function to Turn ON/OFF VOUT Low Dropout Voltage (3.3V): 250mV (Typ.) @IOUT=600mA Excellent Load Regulation: 0.2%/A (Typ.) Excellent Line Regulation: 0.02%/V (Typ.) Low Quiescent Current: 55μA (Typ.) Low Standby Current: 0.01μA (Typ.) Low Output Noise: 50μVRMS PSRR: 100Hz -65dB, 1kHz -65dB OTSD Protection Stable with 1.0μF Flexible Cap: Ceramic, Tantalum and Aluminum Electrolytic Operation Temperature Range: -40°C to 85°C ESD: MM 400V, HBM 4000V; PROD_ID: VREG-12457; VALUE: 3.3V
U$2 = SparkFun-Aesthetics:SPECIAL_INSTRUCTIONS: Special Ordering/Production Instructions Alert Symbol for special PCB ordering instructions or unique production process warnings. Ordering Instructions Production Instructions Types of information that should be added to box: Copper weight Soldermask color Silk color PCB thickness Number of layers PCB Standard: 1.6mm FR4 1 oz copper immersion silver plating red soldermask white silkscreen Types of information that should be added to box: Special wash requirements Depaneling instructions Humidification Glue curing Default text settings: 0.07 inch 9% ratio 50% line distance
Y1 = SparkFun-Clocks:CRYSTAL-24MHZ: 24MHz Crystal Datasheet <http://www.sparkfun.com/datasheets/Components/AT-SMD-5x3.pdf> Frequency: 24MHz Frequency Tolerance: ±20ppm Load Capacitance: 12pF SparkFun Products: USB Bit Whacker <https://www.sparkfun.com/products/762>; PROD_ID: XTAL-14845

## Net classes
0 default: width 0.127 mm
1 power: width 0.305 mm
2 3.3V: width 0.559 mm
3 RF: width 0.33 mm, clearance 0.203 mm